# Altium project KS2E_IMD-AMSLatch.PrjPcb
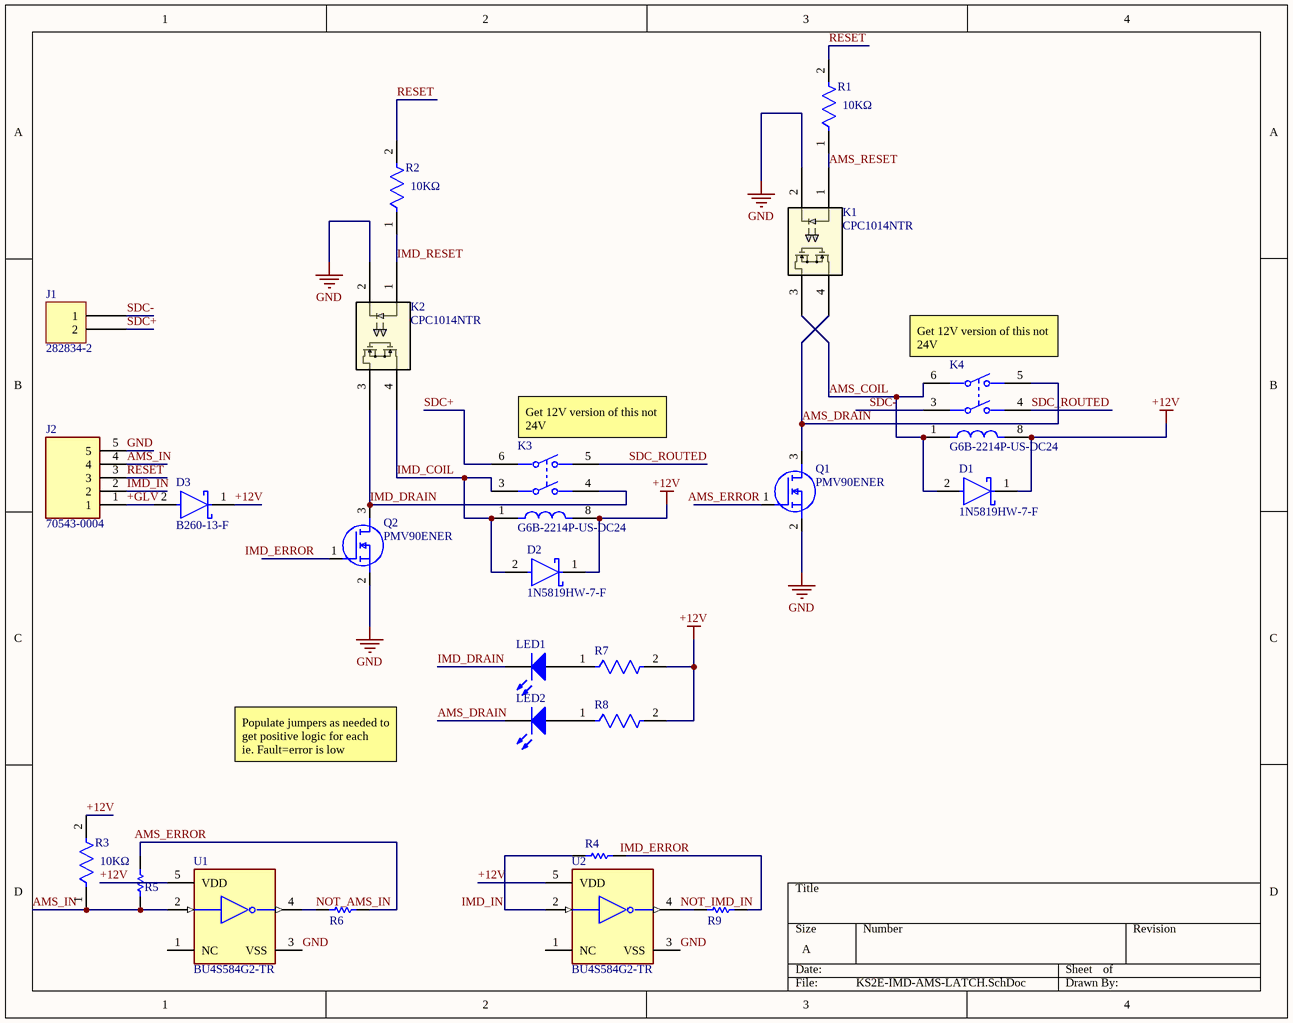
[diagram p0: KS2E-IMD-AMS-LATCH.SchDoc]
1 sheet, 24 parts. Net scope: global (net labels, ports and power ports of the same name join across sheets).
Board file: KS2E-IMD-AMS-LATCH.PcbDoc

## Sheet KS2E-IMD-AMS-LATCH.SchDoc
size A; SheetNumber: 1; SheetTotal: 1

### Parts
D1  1N5819HW-7-F  [FP-SOD123-IPC_A]
D2  1N5819HW-7-F  [FP-SOD123-IPC_A]
D3  B260-13-F  [FP-SMB-MFG]
J1  282834-2  [TE 282834-2]
J2  70543-0004  [SHDR5W64P0X254_1X5_1525X660X1181P]
K1  CPC1014NTR  [CPC1014N_IXY]
K2  CPC1014NTR  [CPC1014N_IXY]
K3  G6B-2214P-US-DC24  [FP-G6B-2214P-US-DC24-MFG]
K4  G6B-2214P-US-DC24  [FP-G6B-2214P-US-DC24-MFG]
LED1  150080SS75000  [0805_A]  (value not drawn)
LED2  150080SS75000  [0805_A]  (value not drawn)
Q1  PMV90ENER  [SOT95P230X110-3N]
Q2  PMV90ENER  [SOT95P230X110-3N]
R1  Resistance: 10KΩ  [FP-RP73P-2A-MFG]  (hidden comment: RP73PF2A10KBTDF)
R2  Resistance: 10KΩ  [FP-RP73P-2A-MFG]  (hidden comment: RP73PF2A10KBTDF)
R3  Resistance: 10KΩ  [FP-RP73P-2A-MFG]  (hidden comment: RP73PF2A10KBTDF)
R4  CRG0805ZR  [RESC2013X65X40LL15T20]  (value not drawn)
R5  CRG0805ZR  [RESC2013X65X40LL15T20]  (value not drawn)
R6  CRG0805ZR  [RESC2013X65X40LL15T20]  (value not drawn)
R7  CRCW1206500RJNEA  [FP-CRCW1206-e3-IPC_B]  (value not drawn)
R8  CRCW1206500RJNEA  [FP-CRCW1206-e3-IPC_B]  (value not drawn)
R9  CRG0805ZR  [RESC2013X65X40LL15T20]  (value not drawn)
U1  BU4S584G2-TR  [FP-SSOP5-MFG]
U2  BU4S584G2-TR  [FP-SSOP5-MFG]

### Nets
+12V: D1.1(C) D2.1(C) D3.1(C) K3.8 K4.8 R3.2 R7.2 R8.2 U1.5(VDD) U2.5(VDD)
GND: J2.5 K1.2 K2.2 Q1.2(S) Q2.2(S) U1.3(VSS) U2.3(VSS)
+GLV: D3.2(A) J2.1
AMS_COIL: D1.2(A) K1.3 K4.1 K4.6
AMS_DRAIN: K1.4 K4.5 LED2.1(K) Q1.3(D)
AMS_ERROR: Q1.1(G) R5.2 R6.2
AMS_IN: J2.4 R3.1 R5.1 U1.2(A)
AMS_RESET: K1.1 R1.1
IMD_COIL: D2.2(A) K2.4 K3.1 K3.3
IMD_DRAIN: K2.3 K3.4 LED1.1(K) Q2.3(D)
IMD_ERROR: Q2.1(G) R4.2 R9.2
IMD_IN: J2.2 R4.1 U2.2(A)
IMD_RESET: K2.1 R2.1
NOT_AMS_IN: R6.1 U1.4(Y)
NOT_IMD_IN: R9.1 U2.4(Y)
RESET: J2.3 R1.2 R2.2
SDC+: J1.2 K3.6
SDC-: J1.1 K4.3
SDC_ROUTED: K3.5 K4.4
NetLED1_2: LED1.2(A) R7.1
NetLED2_2: LED2.2(A) R8.1

Not connected (* = marked no-connect by the designer): U1 1(NC); U2 1(NC)

### Notes on the sheet
- (near K4) Get 12V version of this not 24V
- (near K3) Get 12V version of this not 24V
- Populate jumpers as needed to get positive logic for each
  ie. Fault=error is low

### Library data of the parts
D1 D2 = CMP-0303-00003-3: DIODE SCHOTTKY 40V 1A SOD123; Forward Voltage: 450mV; Capacitance: 110pF; Max Forward Surge Current (Ifsm): 25A; Peak Reverse Current: 50uA; Polarity: Standard; Element Configuration: Single; Max Power Dissipation: 450mW; Min Operating Temperature: -65°C; Package Quantity: 3000; Contact Plating: Tin; Weight: 0.000353oz; Max Repetitive Reverse Voltage (Vrrm): 40V; Max Reverse Voltage (DC): 40V; Height: 1.25mm; Average Rectified Current: 1A; Width: 1.7mm; Case/Package: SOD-123-2; Lead Free: Lead Free; Max Operating Temperature: 125°C; Current Rating: 1A; Termination: SMD/SMT; Forward Current: 1A; Radiation Hardening: No; Number of Pins: 2; Length: 2.85mm; Voltage Rating (DC): 40V; REACH SVHC: No SVHC; Peak Non-Repetitive Surge Current: 25A; Packaging: Tape and Reel; Output Current: 1A
D3 = CMP-12790-000014-1: DIODE SCHOTTKY 60V 2A SMB; Manufacturer: Diodes Inc.; Max Surge Forward Current: 50A; Value: 200pF; Max Junction Temp: +150°C; Standoff Height: 0.05mm; Peak Reverse Current: 0.5mA; Device Class L1: Discrete Semiconductors; Temperature Range High: +150°C; Device Class L3: Schottky Diodes; ComponentLink2Description: Datasheet; Height: 2.5mm; Automotive: No; ComponentLink2URL: https://www.diodes.com/assets/Datasheets/ds13004.pdf; Temperature: -65°C to +150°C; Mouser Description: Schottky Diodes & Rectifiers 60V 2A; Temperature Range Low: -65°C; Capacitance: 200pF; Device Class L2: Diodes; Forward Current: 2A; Lead Free: Yes; Manufacturer Part Number: B260-13-F; Octopart: https://octopart.com/b260-13-f-diodes+inc.-325789; Max Repetitive Reverse Voltage: 60V; Reverse Voltage: 60V; Package: SMB; Footprint Url: https://www.diodes.com/assets/Package-Files/SMB.pdf; Digikey Description: DIODE SCHOTTKY 60V 2A SMB; Category: Diode; RoHS: TRUE
J1 = 282834-2: TERM BLK 2P SIDE ENT 2.54MM PCB; Manufacturer: TE Connectivity AMP Connectors; Current: 10A; Mating Orientation: Horizontal with Board; Number of Levels: 1; Pitch: 0.100" (2.54mm); Positions Per Level: 2; Voltage: 150V; Wire Gauge: 16-30 AWG; Wire Termination: Screw - Rising Cage Clamp; Part Number: 282834-2; Color: Green; ComponentLink1Description: Datasheet; ComponentLink1URL: https://www.te.com/commerce/DocumentDelivery/DDEController?Action=srchrtrv&DocNm=282834&DocType=Customer+Drawing&DocLang=English; ComponentLink2Description: DigiKey Link; ComponentLink2URL: http://digikey.com/product-detail/en/te-connectivity-amp-connectors/282834-2/A98333-ND/1150135; LastUpdated: 1/15/2020 4:15:38 AM; Lifecycle Status: Active; Minimum Order: 1; Mounting Type: Through Hole; Packaging: Bulk; Part Status: Active; Price: 0.88; Series: Buchanan; Supplier 1: DigiKey; Supplier Part Number 1: A98333-ND
J2 = 70543-0004: Connector; Manufacturer_Name: Molex; Datasheet Link: https://componentsearchengine.com/Datasheets/2/70543-0004.pdf; Height: 11.81mm; Manufacturer_Part_Number: 70543-0004; Mouser Part Number: 538-70543-0004; Mouser Price/Stock: https://www.mouser.co.uk/ProductDetail/Molex/70543-0004?qs=ZwgtpdmWYYQRmWofVdhxiw%3D%3D
K1 K2 = CPC1014NTR: No Description Available; Mfr_Name: Littelfuse Inc; Copyright: Copyright (C) 2022 Ultra Librarian. All rights reserved.; Manufacturer_Part_Number: CPC1014NTR; Digi-Key_Part_Number_1: CLA314TR-ND; Digi-Key_Part_Number_2: CLA314CT-ND; Digi-Key_Part_Number_3: CLA314DKR-ND; RefDes: RefDes; Type: DEV
K3 K4 = CMP-08822-000243-1: RELAY GEN PURPOSE DPST 5A 24V; Voltage Rating (DC): 125V; Release Time: 10ms; Relay Type: General Purpose; Coil Current: 8.3mA; Coil Power: 300mW; Max Voltage Rating (AC): 380V; Approvals: UL; Power Consumption: 200mW; Coil Type: Non-Latching; Coil Resistance: 2.88kR; Number of Pins: 6; Width: 10mm; Radiation Hardening: No; Contact Current Rating: 5A; Length: 20mm; Min Operating Temperature: -25°C; Operate Time: 10ms; Max Voltage Rating (DC): 125V; Depth: 11mm; Packaging: Bulk; Lead Free: Lead Free; Contact Material: Silver; Case/Package: DIP; Throw Configuration: DPST; Mount: Through Hole; Max Operating Temperature: 70°C; Coil Voltage (DC): 24V; Max Current Rating: 5A; Height: 10mm; Package Quantity: 100; Weight: 0.141096oz; Voltage Rating (AC): 380V; Current Rating: 5A; Series: G6B; Termination: PC Pin
LED1 LED2 = CMP-1426-00010-1: SMD mono-color Chip LED, WL-SMCW, Super Red; Manufacturer: Wuerth Elektronik; PackageReference: 0805_A; ComponentLink2URL: http://katalog.we-online.com/led/datasheet/150080SS75000.pdf; ComponentLink1URL: http://www.we-online.com; Color: Super Red; ComponentLink2Description: Datasheet; ComponentLink1Description: Manufacturer URL; PartNumber: 150080SS75000
Q1 Q2 = PMV90ENER: MOSFET (N-Channel); Manufacturer_Name: Nexperia; Datasheet Link: https://assets.nexperia.com/documents/data-sheet/PMV90ENE.pdf; Height: 1.1mm; Manufacturer_Part_Number: PMV90ENER; Mouser Part Number: 771-PMV90ENER; Mouser Price/Stock: https://www.mouser.co.uk/ProductDetail/Nexperia/PMV90ENER?qs=gH1BdSMZm8U46al1TitK1w%3D%3D; Arrow Part Number: PMV90ENER; Arrow Price/Stock: https://www.arrow.com/en/products/pmv90ener/nexperia
R1-R3 = CMP-03211-008023-1: RP73P 0805 10KΩ 0.25W 25ppm/°C 0.10% 150V; Manufacturer: TE Connectivity; Tolerance: 0.001; Package: RP73P-2A; ComponentLink2URL: https://www.te.com/commerce/DocumentDelivery/DDEController?Action=srchrtrv&DocNm=1773272&DocType=DS&DocLang=English; Series: RP73P; Manufacturer Part Number: RP73PF2A10KBTDF; ComponentLink2Description: Datasheet; RoHS: TRUE; Category: Res; Device Class L3: Chip SMD Resistors; Device Class L2: Resistors; Device Class L1: Passive Components; Temperature: -55°C to +155°C; Temperature Coefficient: 25ppm/°C; Temperature Range Low: -55°C; Power Rating: 0.25W; Octopart: https://octopart.com/2176093-5-te+connectivity-46441071; Ipc Land Pattern Name: RESC200125X55; Automotive: No; Composition: Thin Film; Lead Free: Yes; Value: 10KΩ; Height: 0.65mm; Voltage Rating: 150V; Temperature Range High: +155°C
R4-R6 R9 = CMP-2000-07514-1: Chip Resistor, 0 Ohm, 0.125 W, -55 to 125 degC, 0805 (2012 Metric), RoHS, Tape and Reel; Manufacturer: TE Connectivity; Power Rating: 125mW; Voltage Rating: 150V; Tolerance: 0%; Case\/Package: 0805; Number of Resistors: 1; Resistance: 0mOhm; Datasheet URL: www.te.com/commerce/DocumentDelivery/DDEController?Action=showdoc&DocId=Customer+Drawing%7F1623401%7FBA%7Fpdf%7FEnglish%7FENG_CD_1623401_BA.pdf%7F1623401-1; Composition: ThickFilm; Max Operating Temperature: 125degC; Min Operating Temperature: -55degC; ELV: Compliant; Case Code (Metric): 2012; Number of Terminations: 2; Weight: 0.000194oz; Length: 2mm; Mount: SurfaceMount; Packaging: TapeandReel; Case Code (Imperial): 0805; RoHSCompliant: true; Width: 1.25mm; Radiation Hardening: No; Termination: Solder; Manufacturer URL: http://www.te.com/; Package Description: 2-Pin Surface Mount Device, Body 2 x 1.25 mm; Mounting Technology: SurfaceMount; Height: 0.55mm; Package Quantity: 5000; Package Reference: RESC2013X65X40L15T20; Datasheet Version: Rev. BA, 12/2009; Depth: 1.25mm
R7 R8 = CMP-02407-007735-1: RES Thick Film, 500Ω, 5%, 0.25W, 200ppm/°C, 1206; Resistance: 500R; Composition: Thick Film; Radiation Hardening: No; Case/Package: 1206; Packaging: Tape and Reel; Temperature Coefficient: 200ppm/°C; Tolerance: 5%; Contact Plating: Tin; Lead Free: Lead Free; Min Operating Temperature: -55°C; Max Operating Temperature: 155°C
U1 U2 = CMP-08923-000001-1: IC INVERTER SCHMITT 1CH 5SSOP; Manufacturer: Rohm; Standoff Height: 0mm; Number Of Outputs: 1; Logic Function Desc: Inverting; Quiescent Current: 0.2-1uA; Propagation Delay: 50ns; Max Supply Voltage: 16V; Description: Inverters IC SCHMITT TRIGGER SINGLE; Min Supply Voltage: 3V; Max Junction Temp: +150°C; Octopart: https://octopart.com/bu4s584g2-tr-rohm-466637; Temperature Range High: +85°C; Footprint Url: https://d1d2qsbl8m0m72.cloudfront.net/en/techdata_basic/ic/package/ssop5_1-e.pdf; ComponentLink2Description: Datasheet; Temperature Range Low: -40°C; Height: 1.25mm; Device Class L1: Integrated Circuits (ICs); Ipc Land Pattern Name: SOT95P280X125-5; Mouser Description: Inverters IC SCHMITT TRIGGER SINGLE; Digikey Description: IC INVERTER SCHMITT 1CH 5SSOP; Category: IC; Device Class L3: Logic Gates; Lead Free: Yes; Automotive: No; Number Of Circuits: 1; Package: SSOP5; Manufacturer Part Number: BU4S584G2-TR; Number Of Inputs: 1; ComponentLink2URL: https://www.rohm.com/datasheet/BU4S584G2/bu4s584g2-e; Device Class L2: Logic ICs; Temperature: -40°C to +85°C; RoHS: TRUE